# Altium project RainbowClock.PrjPcb
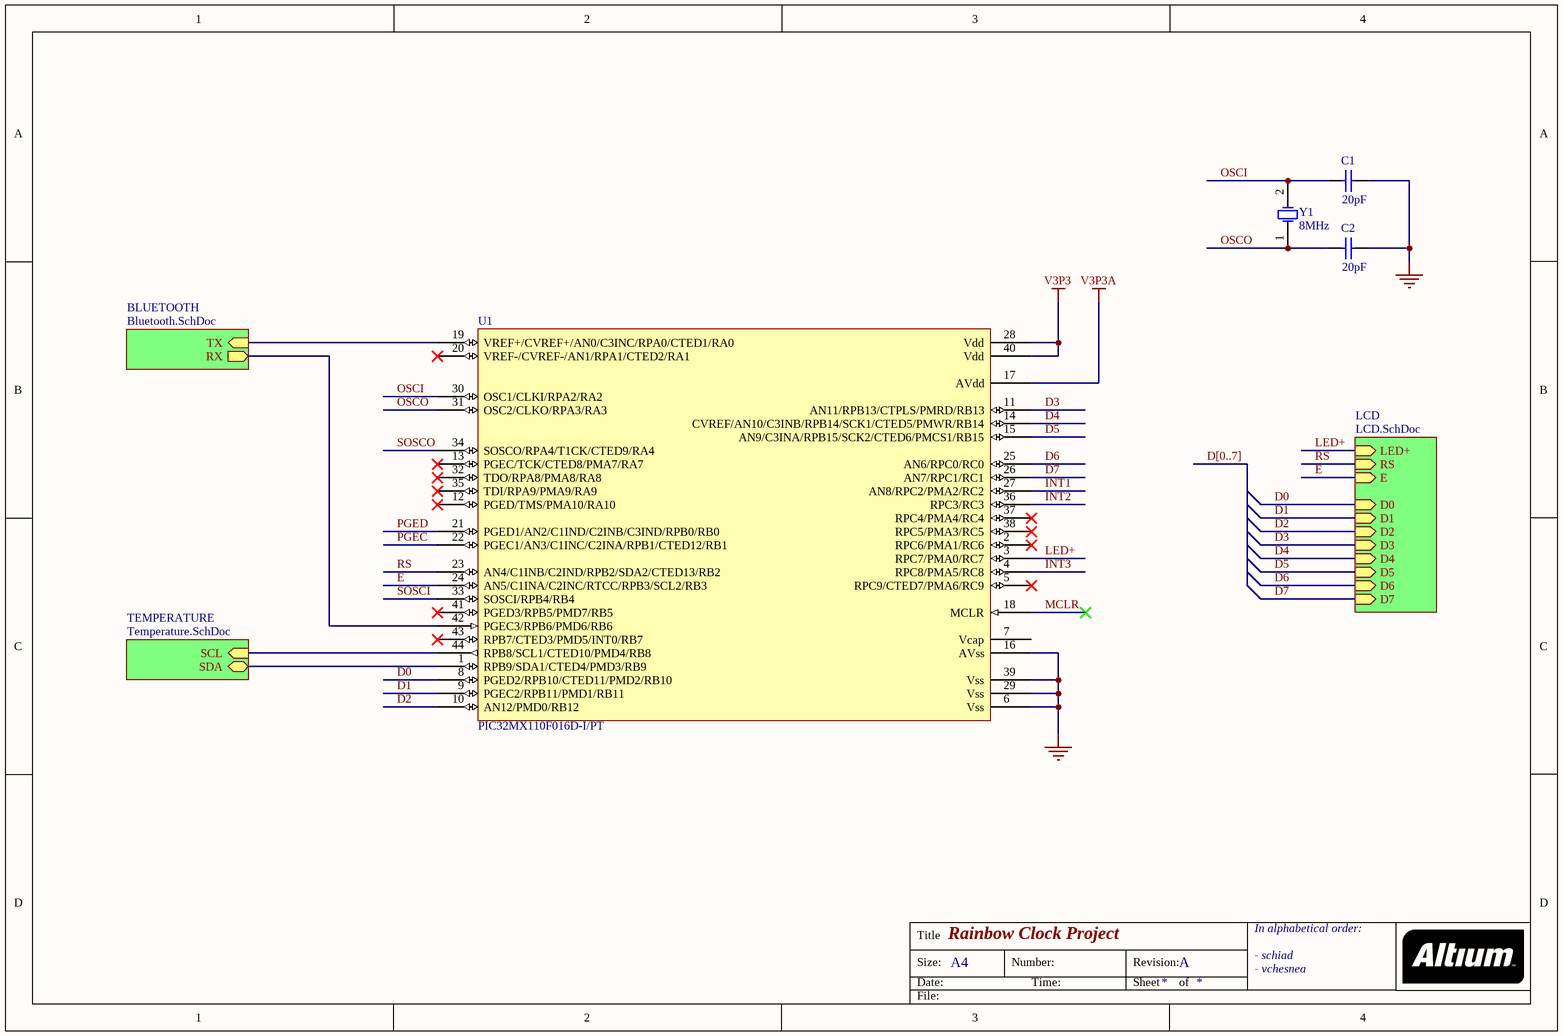
[diagram p0: RainbowClock.SchDoc]
2 sheets, 5 parts. Net scope: hierarchical (ports join the sheet entries above them; power ports are global).
Sheets:
  RainbowClock.SchDoc
    TEMPERATURE = Temperature.SchDoc

## Sheet RainbowClock.SchDoc: Rainbow Clock Project
size A4; DrawnBy: vchesnea; Organization: In alphabetical order:; Address2: - schiad; Address3: - vchesnea; Revision: A

### Parts
C1  value 20pF  [RAD-0.3]  (hidden comment: Cap)
C2  value 20pF  [RAD-0.3]  (hidden comment: Cap)
U1  PIC32MX110F016D-I/PT
Y1  8MHz  [R38]

### Sub-sheets
BLUETOOTH = Bluetooth.SchDoc (file not in this document): TX (in), RX (out)
LCD = LCD.SchDoc (file not in this document): RS (in), E (in), D0 (in), D1 (in), D2 (in), D3 (in), D4 (in), D5 (in), D6 (in), D7 (in), LED+ (in)
TEMPERATURE = Temperature.SchDoc: SDA (bidir), SCL (in)

### Nets
GND: C1.2 C2.2 U1.6(Vss) U1.16(AVss) U1.29(Vss) U1.39(Vss)
V3P3: U1.28(Vdd) U1.40(Vdd)
V3P3A: U1.17(AVdd)
D0: U1.8(PGED2/RPB10/CTED11/PMD2/RB10) ; sheet LCD/D0
D1: U1.9(PGEC2/RPB11/PMD1/RB11) ; sheet LCD/D1
D2: U1.10(AN12/PMD0/RB12) ; sheet LCD/D2
D3: U1.11(AN11/RPB13/CTPLS/PMRD/RB13) ; sheet LCD/D3
D4: U1.14(CVREF/AN10/C3INB/RPB14/SCK1/CTED5/PMWR/RB14) ; sheet LCD/D4
D5: U1.15(AN9/C3INA/RPB15/SCK2/CTED6/PMCS1/RB15) ; sheet LCD/D5
D6: U1.25(AN6/RPC0/RC0) ; sheet LCD/D6
D7: U1.26(AN7/RPC1/RC1) ; sheet LCD/D7
E: U1.24(AN5/C1INA/C2INC/RTCC/RPB3/SCL2/RB3) ; sheet LCD/E
INT1: U1.27(AN8/RPC2/PMA2/RC2)
INT2: U1.36(RPC3/RC3)
INT3: U1.4(RPC8/PMA5/RC8)
LED+: U1.3(RPC7/PMA0/RC7) ; sheet LCD/LED+
MCLR: U1.18(MCLR)
OSCI: C1.1 U1.30(OSC1/CLKI/RPA2/RA2) Y1.2(OSC2)
OSCO: C2.1 U1.31(OSC2/CLKO/RPA3/RA3) Y1.1(OSC1)
PGEC: U1.22(PGEC1/AN3/C1INC/C2INA/RPB1/CTED12/RB1)
PGED: U1.21(PGED1/AN2/C1IND/C2INB/C3IND/RPB0/RB0)
RS: U1.23(AN4/C1INB/C2IND/RPB2/SDA2/CTED13/RB2) ; sheet LCD/RS
SOSCI: U1.33(SOSCI/RPB4/RB4)
SOSCO: U1.34(SOSCO/RPA4/T1CK/CTED9/RA4)
NetU1_1: U1.1(RPB9/SDA1/CTED4/PMD3/RB9) ; sheet TEMPERATURE/SDA
NetU1_19: U1.19(VREF+/CVREF+/AN0/C3INC/RPA0/CTED1/RA0) ; sheet BLUETOOTH/TX
NetU1_42: U1.42(PGEC3/RPB6/PMD6/RB6) ; sheet BLUETOOTH/RX
NetU1_44: U1.44(RPB8/SCL1/CTED10/PMD4/RB8) ; sheet TEMPERATURE/SCL

Not connected (* = marked no-connect by the designer): U1 2(RPC6/PMA1/RC6)* 5(RPC9/CTED7/PMA6/RC9)* 7(Vcap) 12(PGED/TMS/PMA10/RA10)* 13(PGEC/TCK/CTED8/PMA7/RA7)* 20(VREF-/CVREF-/AN1/RPA1/CTED2/RA1)* 32(TDO/RPA8/PMA8/RA8)* 35(TDI/RPA9/PMA9/RA9)* 37(RPC4/PMA4/RC4)* 38(RPC5/PMA3/RC5)* 41(PGED3/RPB5/PMD7/RB5)* 43(RPB7/CTED3/PMD5/INT0/RB7)*

### Buses and harness runs
bus D[0..7]

### Notes on the sheet
- Title
- Size:
- Date:
- A4
- Number:
- Time:
- Revision:
- Sheet
- of
- File:

### Library data of the parts
C1 C2 = Cap: Capacitor; Published: 8-Jun-2000; LatestRevisionDate: 17-Jul-2002; LatestRevisionNote: Re-released for DXP Platform.; PackageReference: RAD-0.3; Publisher: Altium Limited; PackageDescription: Radial Cap, Thru-Hole; 2 Leads; 0.3 in Pin Spacing
U1 = PIC32MX110F016D-I/PT: 44-Pin TQFP
Y1 = XTAL: Crystal Oscillator; Published: 8-Jun-2000; LatestRevisionDate: 17-Jul-2002; LatestRevisionNote: Re-released for DXP Platform.; PackageReference: R38; Publisher: Altium Limited; PackageDescription: Crystal, Thru-Hole; 2 Leads; Body 3.1 x 8.2 mm (Dia.xH)

## Sheet Temperature.SchDoc
size A4
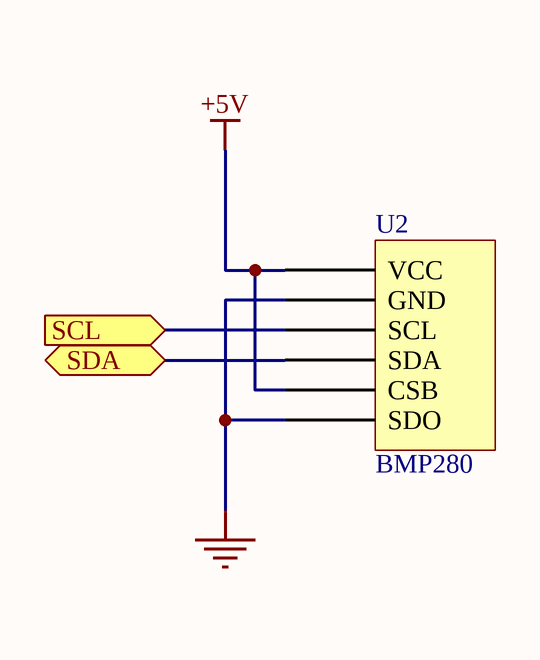
[diagram p1: Temperature.SchDoc]

### Parts
U2  BMP280

### Ports
SCL (in), SDA (bidir)

### Nets
+5V: U2.CSB U2.VCC
GND: U2.GND U2.SDO
NetU1_1: U2.SDA ; port SDA
NetU1_44: U2.SCL ; port SCL

### Notes on the sheet
- Title
- Size:
- Date:
- A4
- Number:
- Time:
- Revision:
- Sheet
- of
- File:

### Library data of the parts
U2 = BMP280: Temperature

## Nets that join several sheets
GND: RainbowClock (6 pins), Temperature (U2.GND U2.SDO)
NetU1_1: RainbowClock (U1.1), Temperature (U2.SDA)
NetU1_44: RainbowClock (U1.44), Temperature (U2.SCL)